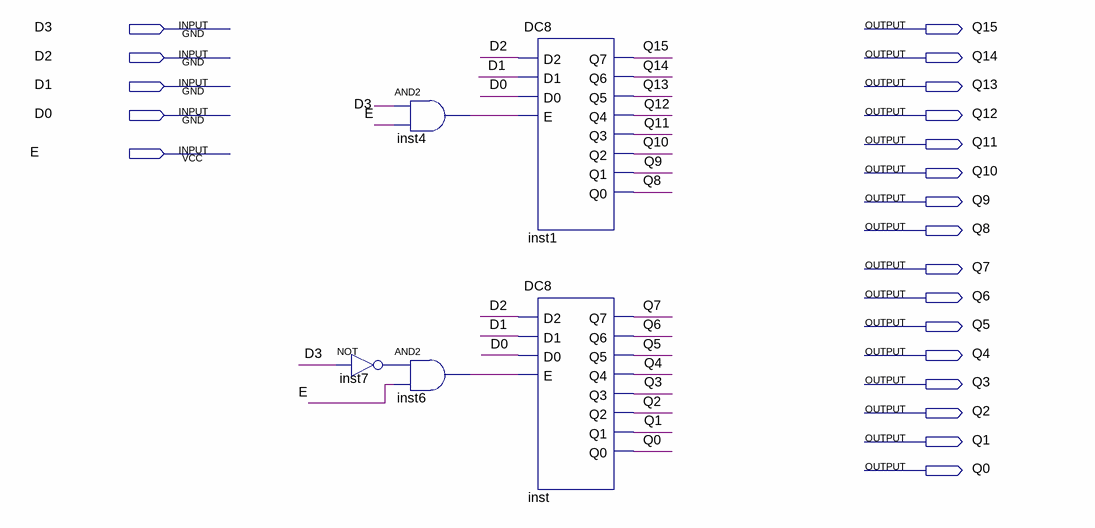
[diagram p0: schematic sheet]
// Quartus schematic DC16.bdf as structural Verilog: 5 symbols, 21 pins
module DC16 (
  input  D3,
  input  D2,
  input  D1,
  input  D0,
  input  E,
  output Q15,
  output Q14,
  output Q13,
  output Q12,
  output Q11,
  output Q10,
  output Q9,
  output Q8,
  output Q7,
  output Q6,
  output Q5,
  output Q4,
  output Q3,
  output Q2,
  output Q1,
  output Q0
);

  wire inst4_out, inst6_out, inst7_out;

  not inst7 (inst7_out, D3);
  and inst4 (inst4_out, D3, E);
  and inst6 (inst6_out, inst7_out, E);
  DC8 inst1 (
    .D2(D2), .D1(D1), .D0(D0), .E(inst4_out), .Q7(Q15), .Q6(Q14), .Q5(Q13), .Q4(Q12), .Q3(Q11), .Q2(Q10),
    .Q1(Q9), .Q0(Q8));
  DC8 inst (
    .D2(D2), .D1(D1), .D0(D0), .E(inst6_out), .Q7(Q7), .Q6(Q6), .Q5(Q5), .Q4(Q4), .Q3(Q3), .Q2(Q2), .Q1(Q1),
    .Q0(Q0));
endmodule
